# EAGLE design Dumb-E (EAGLE 6.4)
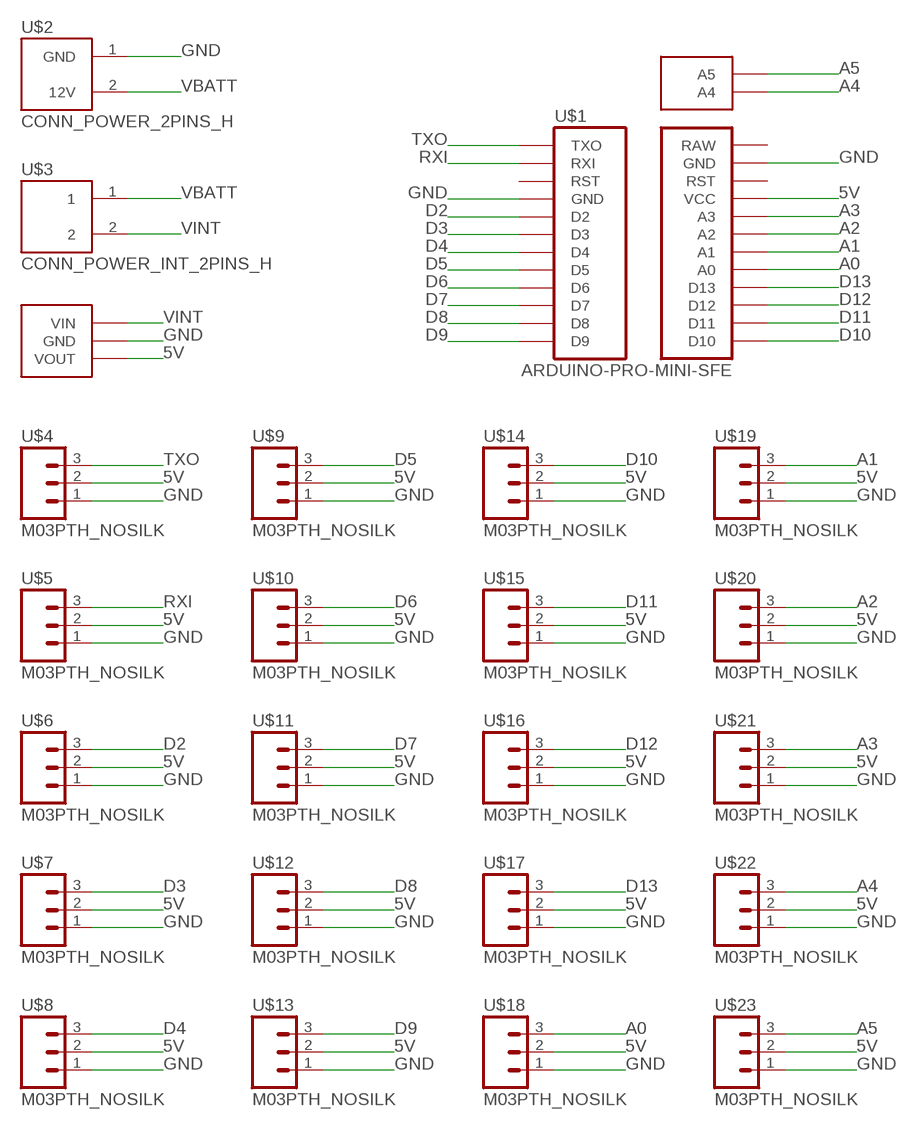
[diagram p0: schematic, sheet 1]

## Parts
U$1  ARDUINO-PRO-MINI-SFE  [ARDUINO-PRO-MINI]
U$2  CONN_POWER_2PINS_H  [2PINS_5MM_90DEG]
U$3  CONN_POWER_INT_2PINS_H  [2PINS_5MM_90DEG]
U$4  M03PTH_NOSILK  [1X03/NOSILK]
U$5  M03PTH_NOSILK  [1X03/NOSILK]
U$6  M03PTH_NOSILK  [1X03/NOSILK]
U$7  M03PTH_NOSILK  [1X03/NOSILK]
U$8  M03PTH_NOSILK  [1X03/NOSILK]
U$9  M03PTH_NOSILK  [1X03/NOSILK]
U$10  M03PTH_NOSILK  [1X03/NOSILK]
U$11  M03PTH_NOSILK  [1X03/NOSILK]
U$12  M03PTH_NOSILK  [1X03/NOSILK]
U$13  M03PTH_NOSILK  [1X03/NOSILK]
U$14  M03PTH_NOSILK  [1X03/NOSILK]
U$15  M03PTH_NOSILK  [1X03/NOSILK]
U$16  M03PTH_NOSILK  [1X03/NOSILK]
U$17  M03PTH_NOSILK  [1X03/NOSILK]
U$18  M03PTH_NOSILK  [1X03/NOSILK]
U$19  M03PTH_NOSILK  [1X03/NOSILK]
U$20  M03PTH_NOSILK  [1X03/NOSILK]
U$21  M03PTH_NOSILK  [1X03/NOSILK]
U$22  M03PTH_NOSILK  [1X03/NOSILK]
U$23  M03PTH_NOSILK  [1X03/NOSILK]
U$25  DE-SW0XX  [DE-SW0XX]

## Nets
5V: U$1.P$17(VCC) U$4.2 U$5.2 U$6.2 U$7.2 U$8.2 U$9.2 U$10.2 U$11.2 U$12.2 U$13.2 U$14.2 U$15.2 U$16.2 U$17.2 U$18.2 U$19.2 U$20.2 U$21.2 U$22.2 U$23.2 U$25.VOUT
A0: U$1.P$9(A0) U$18.3
A1: U$1.P$11(A1) U$19.3
A2: U$1.P$13(A2) U$20.3
A3: U$1.P$15(A3) U$21.3
A4: U$1.P$26(A4) U$22.3
A5: U$1.P$25(A5) U$23.3
D2: U$1.P$16(D2) U$6.3
D3: U$1.P$14(D3) U$7.3
D4: U$1.P$12(D4) U$8.3
D5: U$1.P$10(D5) U$9.3
D6: U$1.P$8(D6) U$10.3
D7: U$1.P$6(D7) U$11.3
D8: U$1.P$4(D8) U$12.3
D9: U$1.P$2(D9) U$13.3
D10: U$1.P$1(D10) U$14.3
D11: U$1.P$3(D11) U$15.3
D12: U$1.P$5(D12) U$16.3
D13: U$1.P$7(D13) U$17.3
GND: U$1.P$18(GND) U$1.P$21(GND) U$2.1(GND) U$4.1 U$5.1 U$6.1 U$7.1 U$8.1 U$9.1 U$10.1 U$11.1 U$12.1 U$13.1 U$14.1 U$15.1 U$16.1 U$17.1 U$18.1 U$19.1 U$20.1 U$21.1 U$22.1 U$23.1 U$25.GND
RXI: U$1.P$22(RXI) U$5.3
TXO: U$1.P$24(TXO) U$4.3
VBATT: U$2.2(12V) U$3.1
VINT: U$3.2 U$25.VIN
Unconnected: U$1.P$19(RST) U$1.P$20(RST) U$1.P$23(RAW)

## Library data of the parts
U$1 = Robot:ARDUINO-PRO-MINI: Arduino Pro Mini This is SparkFun's version of the Arduino Pro Mini board.
U$2 = Robot:CONN_POWER_2PINS: POWER CONNECTOR for DC/DC converter boards and H-bridge motor controllers.
U$3 = Robot:CONN_POWER_INT_2PINS: CONNECTOR FOR A POWER INTERRUPTER
U$4-U$23 = Robot:M03: 3-PIN HEADER Standard 3-pin 0.1" header.
U$25 = Robot:DE-SW0XX

## Board
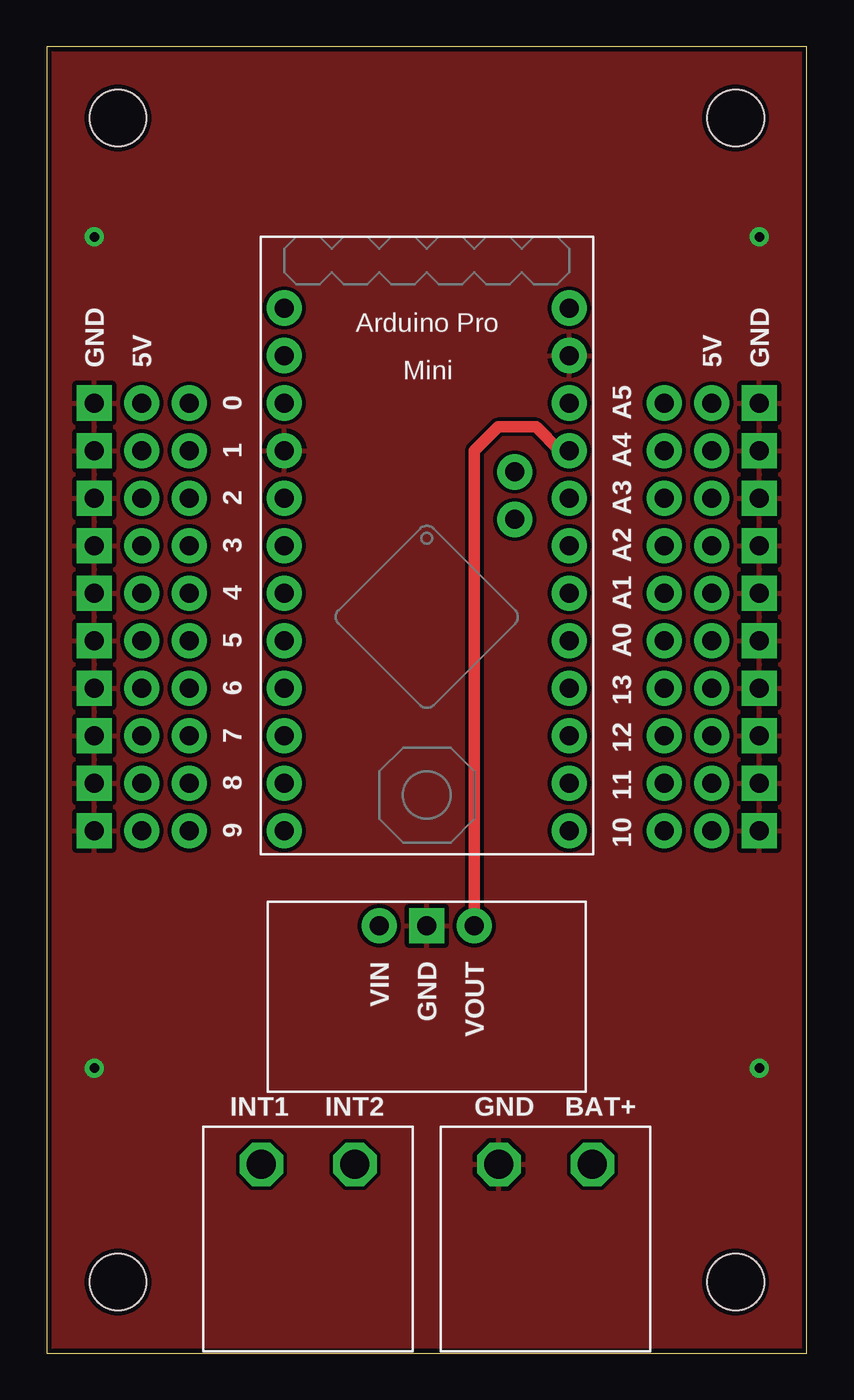
[diagram p1: board, top side]
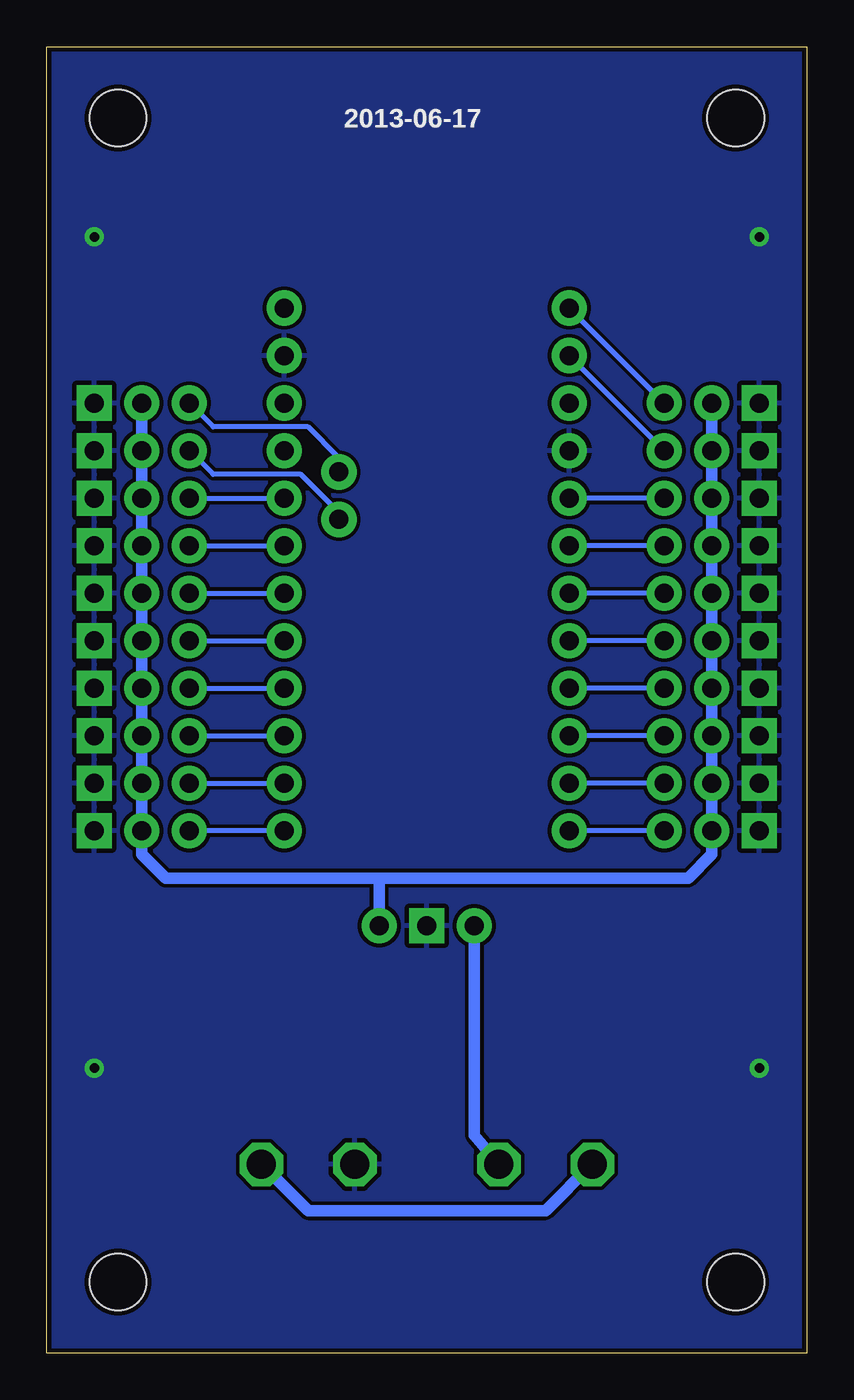
[diagram p2: board, bottom side, seen from below]

Size 40.64 x 69.85 mm. Coordinates in mm from the lower left corner, seen from the top.
Outline: 0,0 40.64,0 40.64,69.85 0,69.85 0,0
Copper layers (1*16): Top 0.035mm / dielectric 1.5mm / Bottom 0.035mm
Design rules "SparkFun": minimum track width 8mil, minimum drill 20mil, track to track 8mil, track to pad 8mil, pad to pad 8mil, via to via 8mil, smd to smd 8mil, copper to edge 10mil, drill to drill 8mil, minimum pad ring 12mil, minimum via ring 10mil, stop-mask expansion 4mil, vias tented up to drill 25mil, thermal gap 10mil
Holes 3.05 mm at 3.81,3.81 36.83,3.81 36.83,66.04 3.81,66.04

### Footprints (pad centres in the part's own frame; a part is rotated, then mirrored left to right if it is on the bottom)
ARDUINO-PRO-MINI = drill 1.016 pad 1.88: P$1 16.51,1.27; P$2 1.27,1.27; P$3 16.51,3.81; P$4 1.27,3.81; P$5 16.51,6.35; P$6 1.27,6.35; P$7 16.51,8.89; P$8 1.27,8.89; P$9 16.51,11.43; P$10 1.27,11.43; P$11 16.51,13.97; P$12 1.27,13.97; P$13 16.51,16.51; P$14 1.27,16.51; P$15 16.51,19.05; P$16 1.27,19.05; P$17 16.51,21.59; P$18 1.27,21.59; P$19 16.51,24.13; P$20 1.27,24.13; P$21 16.51,26.67; P$22 1.27,26.67; P$23 16.51,29.21; P$24 1.27,29.21; P$25 13.589,20.447; P$26 13.589,17.907
2PINS_5MM_90DEG = drill 1.55 octagon: 1 -2.5,4; 2 2.5,4
1X03/NOSILK = drill 1.016 pad 1.88 square: 1 -2.54,0 | drill 1.016 pad 1.88: 2 0,0; 3 2.54,0
DE-SW0XX = drill 1.016 pad 1.88 square: GND 0,0 | drill 1.016 pad 1.88: VIN 2.54,0; VOUT -2.54,0

### Placement (x,y rotation side)
U$1  11.43,26.67 0 top
U$2  26.67,6.1 0 top
U$3  13.97,6.1 0 top
U$4  5.08,50.8 0 top
U$5  5.08,48.26 0 top
U$6  5.08,45.72 0 top
U$7  5.08,43.18 0 top
U$8  5.08,40.64 0 top
U$9  5.08,38.1 0 top
U$10  5.08,35.56 0 top
U$11  5.08,33.02 0 top
U$12  5.08,30.48 0 top
U$13  5.08,27.94 0 top
U$14  35.56,27.94 180 top
U$15  35.56,30.48 180 top
U$16  35.56,33.02 180 top
U$17  35.56,35.56 180 top
U$18  35.56,38.1 180 top
U$19  35.56,40.64 180 top
U$20  35.56,43.18 180 top
U$21  35.56,45.72 180 top
U$22  35.56,48.26 180 top
U$23  35.56,50.8 180 top
U$25  20.32,22.86 180 top

### Tracks (layer width: path | path; a pad name or v marks a point on that pad's centre or on a via)
5V
  Top 0.61: U$1.P$17 27.43,48.26 26.16,49.53 24.13,49.53 22.86,48.26 U$25.VOUT
  Bottom 0.61: U$23.2 U$22.2 U$21.2 U$20.2 U$19.2 U$18.2 U$17.2 U$16.2 U$15.2 U$14.2 35.56,26.67 34.29,25.4 22.86,25.4 | U$4.2 U$5.2 U$6.2 U$7.2 U$8.2 U$9.2 U$10.2 U$11.2 U$12.2 U$13.2 5.08,26.67 6.35,25.4 22.86,25.4 | U$25.VOUT 22.86,25.4
A0
  Bottom 0.254: U$18.3 U$1.P$9
A1
  Bottom 0.254: U$19.3 U$1.P$11
A2
  Bottom 0.254: U$20.3 U$1.P$13
A3
  Bottom 0.254: U$21.3 U$1.P$15
A4
  Bottom 0.254: U$1.P$26 25.02,44.96 27.05,46.99 31.75,46.99 U$22.3
A5
  Bottom 0.254: U$1.P$25 25.02,47.88 26.67,49.53 31.75,49.53 U$23.3
D2
  Bottom 0.254: U$6.3 U$1.P$16
D3
  Bottom 0.254: U$7.3 U$1.P$14
D4
  Bottom 0.254: U$8.3 U$1.P$12
D5
  Bottom 0.254: U$9.3 U$1.P$10
D6
  Bottom 0.254: U$10.3 U$1.P$8
D7
  Bottom 0.254: U$11.3 U$1.P$6
D8
  Bottom 0.254: U$12.3 U$1.P$4
D9
  Bottom 0.254: U$13.3 U$1.P$2
D10
  Bottom 0.254: U$1.P$1 U$14.3
D11
  Bottom 0.254: U$15.3 U$1.P$3
D12
  Bottom 0.254: U$16.3 U$1.P$5
D13
  Bottom 0.254: U$17.3 U$1.P$7
GND  (via drill 0.51)
  other vias: 2.54,59.69 38.1,59.69 38.1,15.24 2.54,15.24
  pour Bottom: 0,0 0,69.85 40.64,69.85 40.64,0
  pour Top: 0,0 0,69.85 40.64,69.85 40.64,0
RXI
  Bottom 0.254: U$5.3 U$1.P$22
TXO
  Bottom 0.254: U$4.3 U$1.P$24
VBATT
  Bottom 0.61: U$3.1 11.47,10.12 13.97,7.62 26.67,7.62 29.17,10.12 U$2.2
VINT
  Bottom 0.61: U$25.VIN 17.78,11.66 U$3.2

### Text on the board
tPlace: GND | 5V | 5V | GND | 0 | A5 | 1 | A4 | 2 | A3 | 3 | A2 | 4 | A1 | 5 | A0 | 6 | 13 | 7 | 12 | 8 | 11 | 9 | 10 | VIN | GND | VOUT | INT1 | INT2 | GND | BAT+
bPlace: 2013-06-17